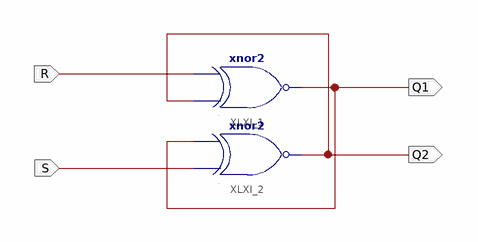
[diagram p0: schematic sheet 1]
// Xilinx ISE schematic XNOR_RSFF.sch (spartan3e) as structural Verilog: 2 symbols, 4 ports
module XNOR_RSFF (
  input  R,
  input  S,
  output Q1,
  output Q2
);

  xnor XLXI_1 (Q1, Q2, R);
  xnor XLXI_2 (Q2, S, Q1);
endmodule
